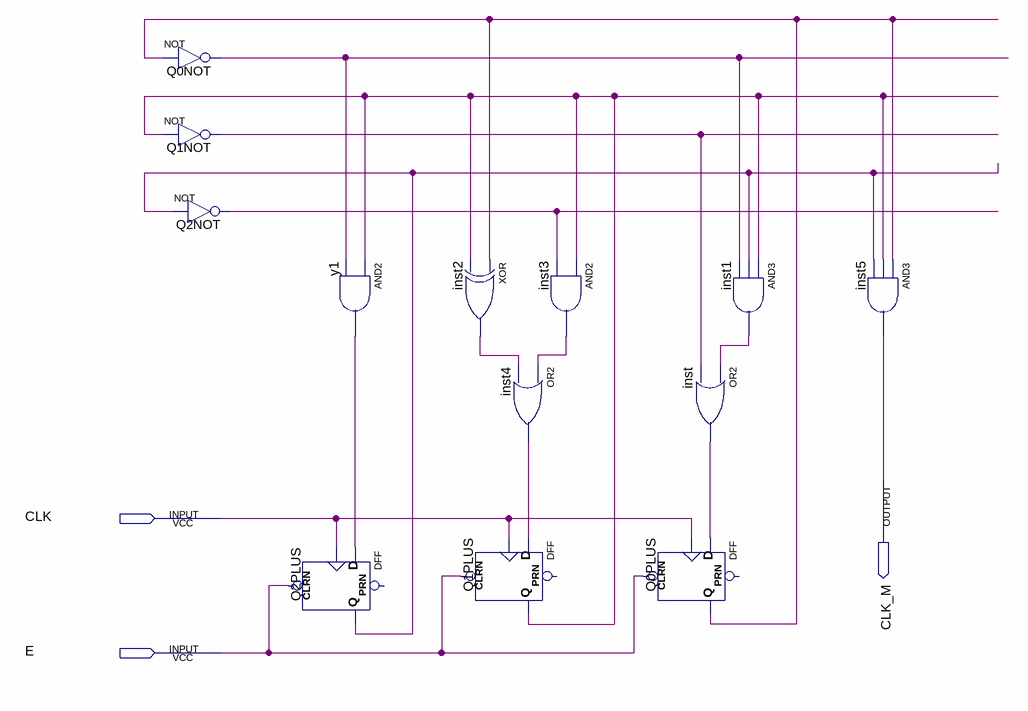
[diagram p0: schematic sheet]
// Quartus schematic Modulo6.bdf as structural Verilog: 13 symbols, 3 pins
module Modulo6 (
  input  CLK,
  input  E,
  output CLK_M
);

  wire inst1_out, inst2_out, inst3_out, inst4_out, inst_out, Q0NOT_out, Q0PLUS_q, Q1NOT_out, Q1PLUS_q,
       Q2NOT_out, Q2PLUS_q, y1_out;

  not Q0NOT (Q0NOT_out, Q0PLUS_q);
  not Q1NOT (Q1NOT_out, Q1PLUS_q);
  not Q2NOT (Q2NOT_out, Q2PLUS_q);
  and y1 (y1_out, Q1PLUS_q, Q0NOT_out);
  DFF Q2PLUS (.CLRN(E), .CLK(CLK), .D(y1_out), .Q(Q2PLUS_q));  // open: PRN
  xor inst2 (inst2_out, Q0PLUS_q, Q1PLUS_q);
  or inst4 (inst4_out, inst3_out, inst2_out);
  DFF Q1PLUS (.CLRN(E), .CLK(CLK), .D(inst4_out), .Q(Q1PLUS_q));  // open: PRN
  and inst3 (inst3_out, Q1PLUS_q, Q2NOT_out);
  DFF Q0PLUS (.CLRN(E), .CLK(CLK), .D(inst_out), .Q(Q0PLUS_q));  // open: PRN
  and inst1 (inst1_out, Q1PLUS_q, Q2PLUS_q, Q0NOT_out);
  or inst (inst_out, inst1_out, Q1NOT_out);
  and inst5 (CLK_M, Q0PLUS_q, Q1PLUS_q, Q2PLUS_q);
endmodule
